# EasyEDA Pro project 主轴照明灯板v1.0.eprj

# Schematic 原理图
Board Name: ESP32s3; Create Date: 2025-05-14; Page Name: 电源; Project Name: 主轴照明灯 - 副本; Schematic Name: 原理图; Update Date: 2026-03-27; Company: 嘉立创EDA; Page Size: A3; Version: V1.0
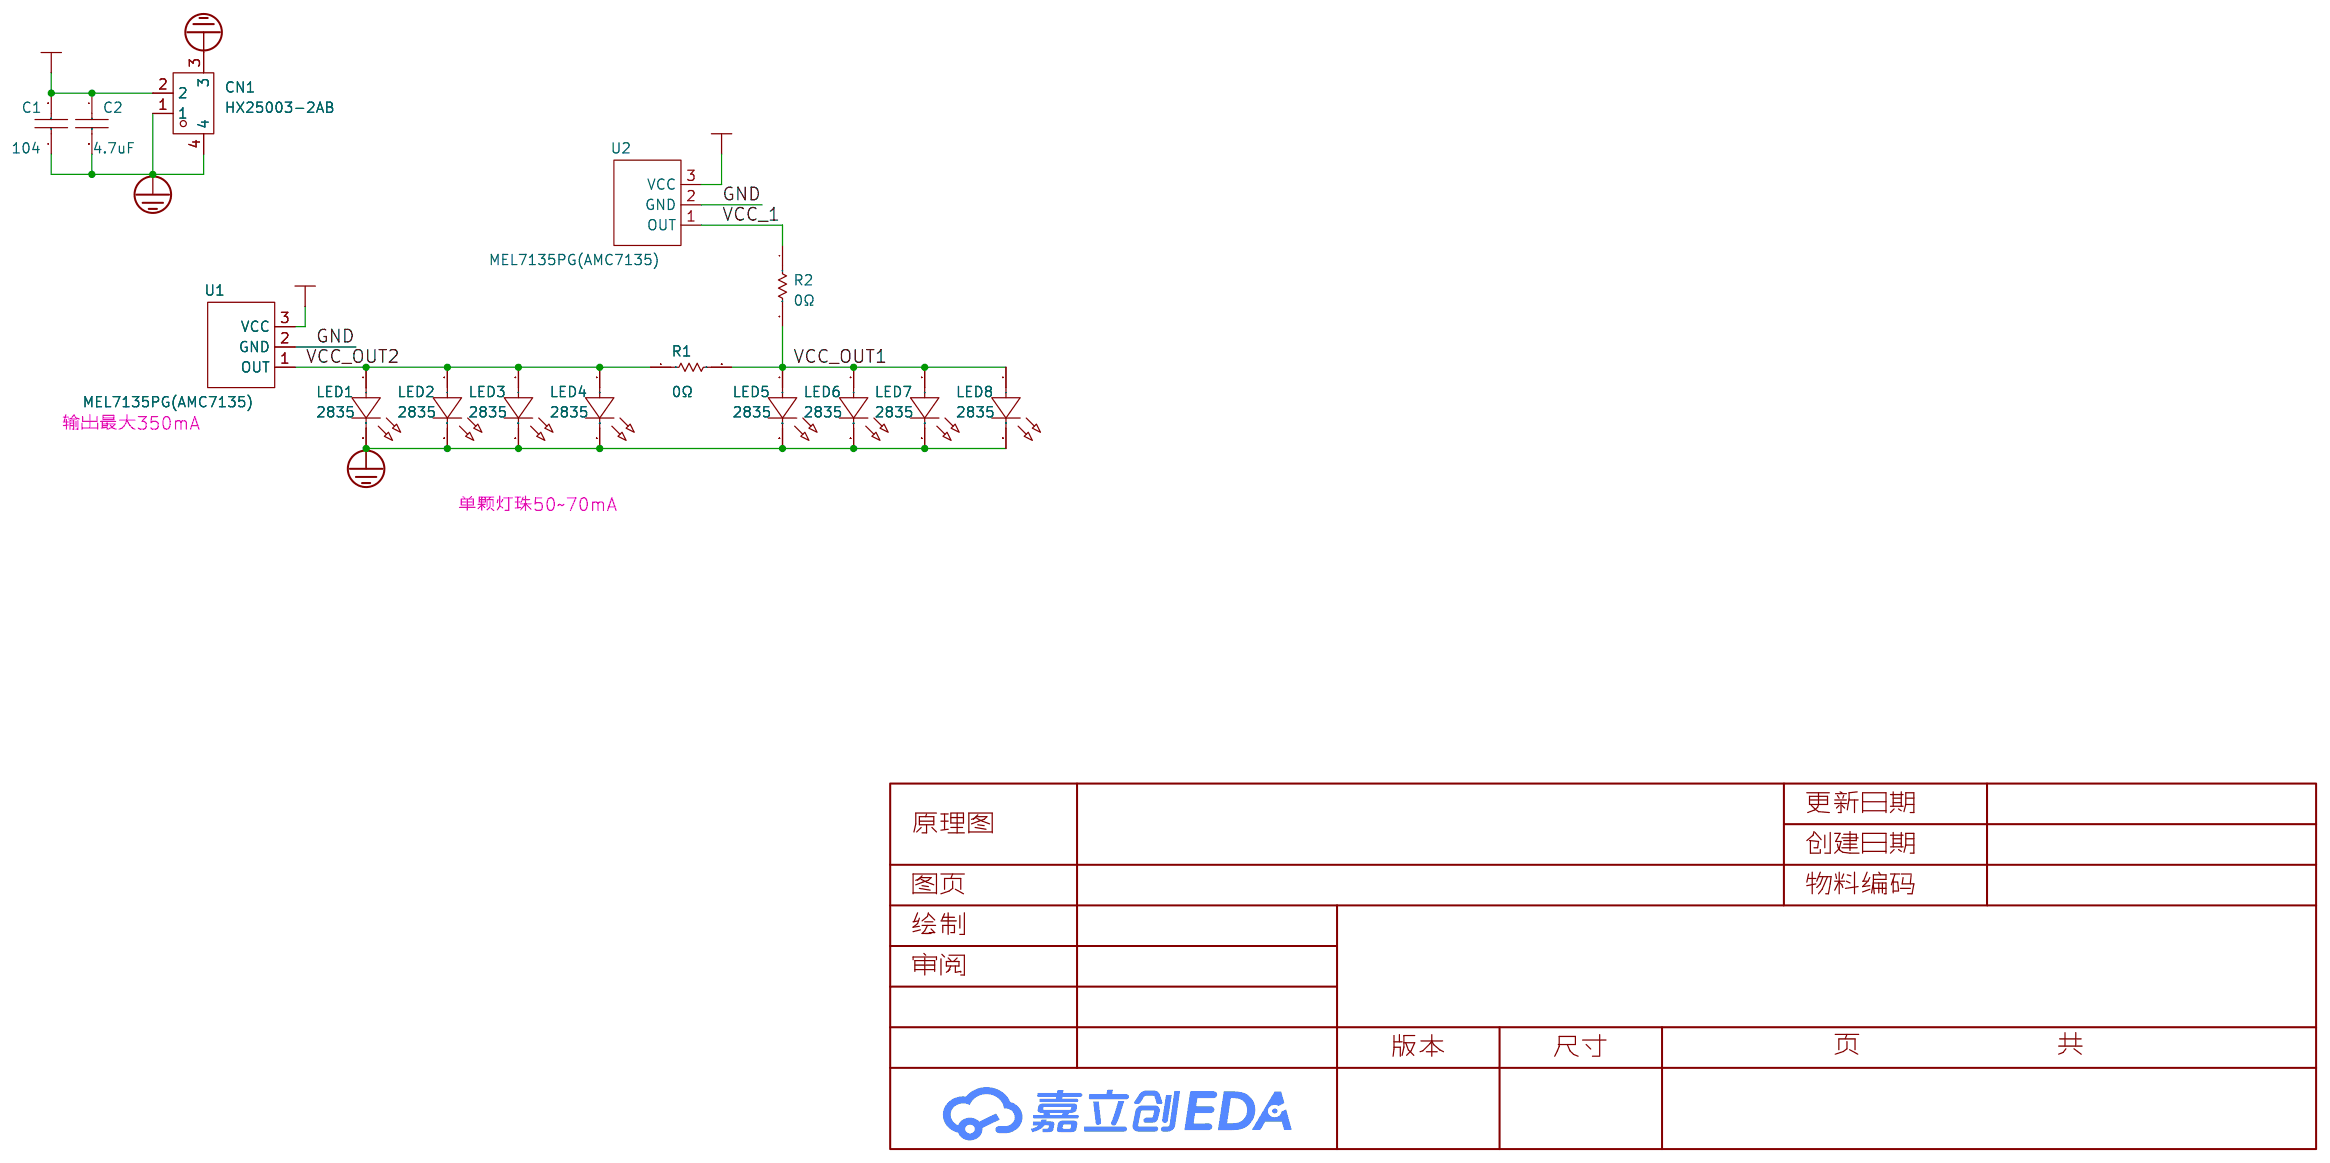
[diagram p0: schematic sheet]

## Parts
C1  104  [0603C]
C2  4.7uF  [0805C]
CN1  HX25003-2AB  [CONN-SMD_P2.50_HX25003-2AB]
LED1  2835  [LED-SMD_L3.5-W2.8_2835]
LED2  2835  [LED-SMD_L3.5-W2.8_2835]
LED3  2835  [LED-SMD_L3.5-W2.8_2835]
LED4  2835  [LED-SMD_L3.5-W2.8_2835]
LED5  2835  [LED-SMD_L3.5-W2.8_2835]
LED6  2835  [LED-SMD_L3.5-W2.8_2835]
LED7  2835  [LED-SMD_L3.5-W2.8_2835]
LED8  2835  [LED-SMD_L3.5-W2.8_2835]
R1  0Ω  [10]
R2  0Ω  [10]
U1  MEL7135PG(AMC7135)  [SOT-89-3_L4.5-W2.5-P1.50-LS4.2-BR]
U2  MEL7135PG(AMC7135)  [SOT-89-3_L4.5-W2.5-P1.50-LS4.2-BR]

## Library data of the parts
C1 = 104: Capacitor (Semiconductor SIM Model); Published: 8-Jun-2000; LatestRevisionDate: 17-Jul-2002; LatestRevisionNote: Re-released for DXP Platform.; PackageReference: C1206; Publisher: Altium Limited; Origin Footprint 2: C1206; Origin Footprint 3: 0402; Origin Footprint 4: 1310[0504]; Origin Footprint 5: 1608[0603]; Origin Footprint 6: C1210; Origin Footprint 7: C0805; Origin Footprint 8: C1206; Origin Footprint 9: 0805; Origin Footprint 10: 0805L; Design Item ID: Cap Semi; Library Name: Miscellaneous Devices
C2 = 105: Design Item ID: CAP; Library Name: SCH--װ--
CN1 = HX25003-2AB: LCSC Part Name: 1x2P 间距:2.5mm 立贴 系列:XH; Supplier Part: C442354; Manufacturer: HX(红星); Supplier Footprint: SMD,P=2.5mm; JLCPCB Part Class: 扩展库; Datasheet: https://item.szlcsc.com/datasheet/HX25003-2AB/442586.html; Supplier: LCSC; Pins Structure: 1x2P; Pitch: 2.5mm; Mounting Type: 立贴; Reference Series: XH; Number of Pins: 2P; Number of Rows: 1; Number of PINs Per Row: 2; Current Rating: 3A; Contact Material: 黄铜; Contact Plating: 锡; Operating Temperature: -25℃~+85℃; Voltage Rating: 250V; Plastic Material: PA66; Flame Retardant Rating: UL94V-0; Color: 白色
LED1-LED8 = 2835: Supplier Part: C9900165166; Supplier Footprint: SMD; Supplier: LCSC
R1 R2 = 10K: Resistor; Published: 8-Jun-2000; LatestRevisionDate: 17-Jul-2002; LatestRevisionNote: Re-released for DXP Platform.; PackageReference: AXIAL-0.3; Publisher: Altium Limited; Origin Footprint 2: AXIAL-0.3; Origin Footprint 3: R0805; Origin Footprint 4: 0805R; Origin Footprint 1: 0603R; Design Item ID: RES; Library Name: SCH封装库
U1 U2 = MEL7135PG: LCSC Part Name: 电流调节器; Supplier Part: C80214; Manufacturer: MICRONE(南京微盟); Supplier Footprint: SOT-89; JLCPCB Part Class: 扩展库; Datasheet: https://item.szlcsc.com/datasheet/MEL7135PG/81359.html; Supplier: LCSC; Voltage - Input(DC): 2.7V~6V; Number of Channels: 1; Output Current: 350mA; Operating temperature: -40℃~+85℃

## Nets
5V_VCC: C1.2 C2.1 CN1.2 U1.3(VCC) U2.3(VCC)
GND: C1.1 C2.2 CN1.1 CN1.3 CN1.4 LED1.2(C) LED2.2(C) LED3.2(C) LED4.2(C) LED5.2(C) LED6.2(C) LED7.2(C) LED8.2(C) U1.2(GND) U2.2(GND)
VCC_1: R2.1 U2.1(OUT)
VCC_OUT1: LED5.1(A) LED6.1(A) LED7.1(A) LED8.1(A) R1.2 R2.2
VCC_OUT2: LED1.1(A) LED2.1(A) LED3.1(A) LED4.1(A) R1.1 U1.1(OUT)

## Notes on the sheet
- 输出最大350mA
- 单颗灯珠50~70mA

# Board PCB
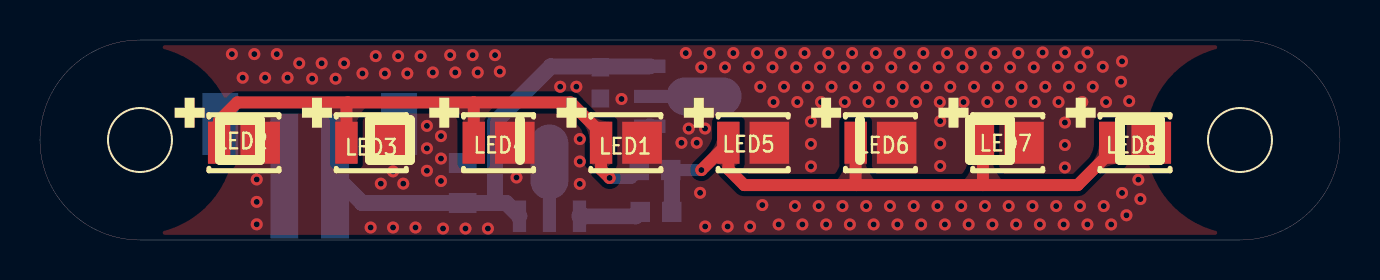
[diagram p1: board, top side]
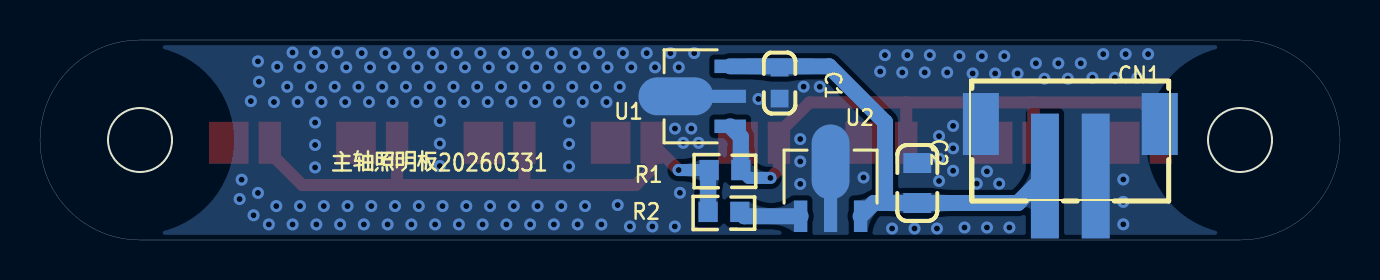
[diagram p2: board, bottom side, seen from below]

Outline 65 x 10 mm; copper layers: Top Layer, Bottom Layer. Coordinates in mm from the lower left corner of the outline.
Outline path: circle c5,5 r1.6 ; circle c60,5 r1.6 ; 5,10 60,10 arc(65,5) 60,0 5,0 arc(0,5) 5,10
Stack: Top Layer 0.035mm / Dielectric1 1.51mm FR4 er 4.5 / Bottom Layer 0.035mm

## Design rules (mm)
template: 用户自定义配置
spacing Default (default): track to track 0.152, other pairs 0 to 0.152
track width Default (default): min 0.254, default 0.254, max 25.4
differential pair differentialPair (default): width min 0.127, default 0.254, max 2.54; gap min 0.152, default 0.152
via Default (default): diameter min 0.25, default 0.61, max 100.025; hole min 0.2, default 0.305, max 59.995

## Placement (name value [footprint] x y rotation side)
C1  104  [0603C]  28.02 7.85 90 bottom
C2  4.7uF  [0805C]  21.14 2.85 90 bottom
CN1  HX25003-2AB  [CONN-SMD_P2.50_HX25003-2AB]  13.49 4.12 0 bottom
LED1  2835  [LED-SMD_L3.5-W2.8_2835]  29.08 4.86 0 top
LED2  2835  [LED-SMD_L3.5-W2.8_2835]  9.98 4.86 0 top
LED3  2835  [LED-SMD_L3.5-W2.8_2835]  16.35 4.86 0 top
LED4  2835  [LED-SMD_L3.5-W2.8_2835]  22.71 4.86 0 top
LED5  2835  [LED-SMD_L3.5-W2.8_2835]  35.44 4.86 0 top
LED6  2835  [LED-SMD_L3.5-W2.8_2835]  41.81 4.86 0 top
LED7  2835  [LED-SMD_L3.5-W2.8_2835]  48.17 4.86 0 top
LED8  2835  [LED-SMD_L3.5-W2.8_2835]  54.54 4.86 0 top
R1  0Ω  [10]  29.86 3.61 0 bottom
R2  0Ω  [10]  29.91 1.52 0 bottom
U1  MEL7135PG(AMC7135)  [SOT-89-3_L4.5-W2.5-P1.50-LS4.2-BR]  31.85 7.18 180 bottom
U2  MEL7135PG(AMC7135)  [SOT-89-3_L4.5-W2.5-P1.50-LS4.2-BR]  25.47 2.54 270 bottom

## Footprints (pads in the part's own frame, mm; a bottom-side part is the same pattern mirrored in y, then rotated)
10
  rect 0.965x1.016 smd: 1(0.101,0.117) 2(1.688,0.117)
0603C
  rect 0.889x0.889 smd: 1(-0.774,0) 2(0.774,0)
0805C
  rect 1x1.4 smd: 1(-1,0) 2(1,0)
CONN-SMD_P2.50_HX25003-2AB
  rect 1.4x6.24 smd: 1(-1.27,0.925) 2(1.27,0.925)
  rect 1.8x3.1 smd: 3(4.47,-1.675) 4(-4.47,-1.675)
LED-SMD_L3.5-W2.8_2835
  rect 1.12x2.1 smd: 1(-1.025,0)
  rect 1.98x2.1 smd: 2(1.025,0)
SOT-89-3_L4.5-W2.5-P1.50-LS4.2-BR
  rect 1.575x0.672 smd: 1(1.356,-1.5) 3(1.356,1.5)
  custom 5.377x1.9 smd: 2(-1.356,0)

## Nets
As in the schematic.

## Via types
v1: diameter 0.6, hole 0.3, Top Layer to Bottom Layer, 171 vias

## Routing (per net, layer and track width the routed paths; a pad name or vN(x,y) marks a point on that pad's centre or on a via; arc(x,y) is an arc through that point)
5V_VCC: length 23
  Bottom Layer w0.8: U1.3 25.54,8.68 22.75,5.89 22.75,1.85 ; 22.75,1.85 C2.1 16.11,1.85 14.76,3.2 ; 22.75,1.85 23.31,1.85 U2.3
GND:
  vias: v1(9.6,9.3) v1(10.13,8.11) v1(10.72,9.3) v1(10.84,3.03) v1(10.84,1.91) v1(10.84,0.78) v1(11.26,8.11) v1(11.84,9.3) v1(12.38,8.11) v1(12.96,8.84) v1(13.61,8.07) v1(14.08,8.84) v1(14.78,8.07) v1(15.21,8.84) v1(16.12,8.33) v1(16.53,0.62) v1(16.79,9.19) v1(17.04,2.82) v1(17.25,8.33) v1(17.65,3.43) v1(17.65,0.62) v1(17.91,9.19) v1(18.16,2.82) v1(18.37,8.33) v1(18.78,0.62) v1(19.03,9.19) v1(19.35,5.71) v1(19.35,4.58) v1(19.35,3.46) v1(19.64,8.38) v1(20.05,5.19) v1(20.05,4.07) v1(20.05,2.95) v1(20.15,0.57) v1(20.51,9.24) v1(20.76,8.38) v1(21.27,0.57) v1(21.63,9.24) v1(21.89,8.38) v1(22.4,0.57) v1(22.75,9.24) v1(22.99,8.42) v1(23.82,3.12) v1(26.01,7.66) v1(26.82,7.67) v1(26.99,5.05) v1(26.99,3.93) v1(26.99,2.8) v1(29.08,7.05) v1(32.07,4.86) v1(32.29,9.35) v1(32.44,5.57) v1(32.84,4.86) v1(33,2.36) v1(33.06,8.63) v1(33.25,5.57) v1(33.26,0.68) v1(33.48,9.35) v1(34.25,8.63) v1(34.38,0.68) v1(34.67,9.35) v1(35.44,8.63) v1(35.5,0.68) v1(35.85,9.35) v1(36.01,7.66) v1(36.12,1.75) v1(36.63,8.63) v1(36.68,6.9) v1(36.93,0.78) v1(37.04,9.35) v1(37.2,7.66) v1(37.81,8.63) v1(37.75,1.7) v1(37.86,6.9) v1(38.12,0.78) v1(38.23,9.35) v1(38.39,7.66) v1(38.55,5.92) v1(38.55,4.8) v1(38.55,3.68) v1(39,8.63) v1(38.94,1.7) v1(39.05,6.9) v1(39.31,0.78) v1(39.42,9.35) v1(39.58,7.66) v1(40.12,1.7) v1(40.19,8.63) v1(40.24,6.9) v1(40.49,0.78) v1(40.6,9.35) v1(40.76,7.66) v1(41.31,1.7) v1(41.38,8.63) v1(41.43,6.9) v1(41.68,0.78) v1(41.79,9.35) v1(41.95,7.66) v1(42.5,1.7) v1(42.56,8.63) v1(42.61,6.9) v1(42.87,0.78) v1(42.98,9.35) v1(43.14,7.66) v1(43.69,1.7) v1(43.75,8.63) v1(43.8,6.9) v1(44.06,0.78) v1(44.17,9.35) v1(44.33,7.66) v1(44.87,1.7) v1(44.94,8.63) v1(44.99,6.9) v1(45.01,5.94) v1(45.01,4.82) v1(45.01,3.7) v1(45.25,0.78) v1(45.35,9.35) v1(45.51,7.66) v1(46.13,8.63) v1(46.06,1.7) v1(46.18,6.9) v1(46.43,0.78) v1(46.54,9.35) v1(46.7,7.66) v1(47.31,8.63) v1(47.25,1.7) v1(47.36,6.9) v1(47.62,0.78) v1(47.73,9.35) v1(47.89,7.66) v1(48.5,8.63) v1(48.44,1.7) v1(48.55,6.9) v1(48.81,0.78) v1(48.92,9.35) v1(49.08,7.66) v1(49.62,1.7) v1(49.69,8.63) v1(49.74,6.9) v1(50,0.78) v1(50.13,9.38) v1(50.26,7.66) v1(50.81,1.7) v1(50.9,8.66) v1(50.93,6.9) v1(51.18,0.78) v1(51.25,9.38) v1(51.25,5.87) v1(51.25,4.75) v1(51.25,3.63) v1(51.45,7.66) v1(52.02,8.66) v1(52,1.7) v1(52.12,6.9) v1(52.37,9.38) v1(52.37,0.78) v1(52.64,7.66) v1(53.14,8.66) v1(53.19,1.7) v1(53.3,6.9) v1(53.56,0.78) v1(54.1,8.93) v1(54.05,7.91) v1(54.1,2.35) v1(54.32,1.24) v1(54.46,6.94) v1(54.92,3.02) v1(55.02,2.05)
VCC_1: length 3.1
  Bottom Layer w0.8: U2.1 29.79,1.19 R2.1
VCC_OUT1: length 31.7
  Top Layer w0.6: 40.81,2.75 40.78,2.78 LED6.1 ; 40.81,2.75 35.21,2.75 34.42,3.54 34.42,4.85 ; 40.81,2.75 47.15,2.75 ; 34.42,4.85 LED5.1 ; 34.42,4.85 v1(33.07,3.5) ; LED8.1 53.51,4.37 51.89,2.75 47.15,2.75 ; LED7.1 47.15,2.75 47.15,2.75
  Bottom Layer w0.6: R1.2 v1(33.07,3.5)
  Bottom Layer w0.8: R2.2 31.6,3.45 R1.2
VCC_OUT2: length 31.7
  Top Layer w0.6: 21.69,6.88 15.38,6.88 ; 21.69,6.88 21.69,6.88 LED4.1 ; 21.69,6.88 26.53,6.88 28.05,5.35 LED1.1 28.05,3.53 v1(28.48,3.1) ; 15.38,6.88 15.32,6.82 LED3.1 ; 15.38,6.88 9.86,6.88 8.96,5.97 LED2.1
  Bottom Layer w0.6: v1(28.48,3.1) 29.56,3.1 R1.1
  Bottom Layer w0.8: R1.1 29.96,5.15 U1.1

## Copper pours and planes (outline as drawn; the poured copper is in the pictures)
GND on Top Layer: -2.5,12.04 65.74,12.04 65.74,-2.14 -2.5,-2.14
GND on Bottom Layer: -2.5,12.04 65.74,12.04 65.74,-2.14 -2.5,-2.14

Small or netless copper shapes (teardrops, artwork), in the pictures only: 14 on Top Layer, 13 on Bottom Layer

## Text on the board
Bottom Silkscreen Layer: 主轴照明板20260331
